# EAGLE design nautilus-board (EAGLE 9.2.2)
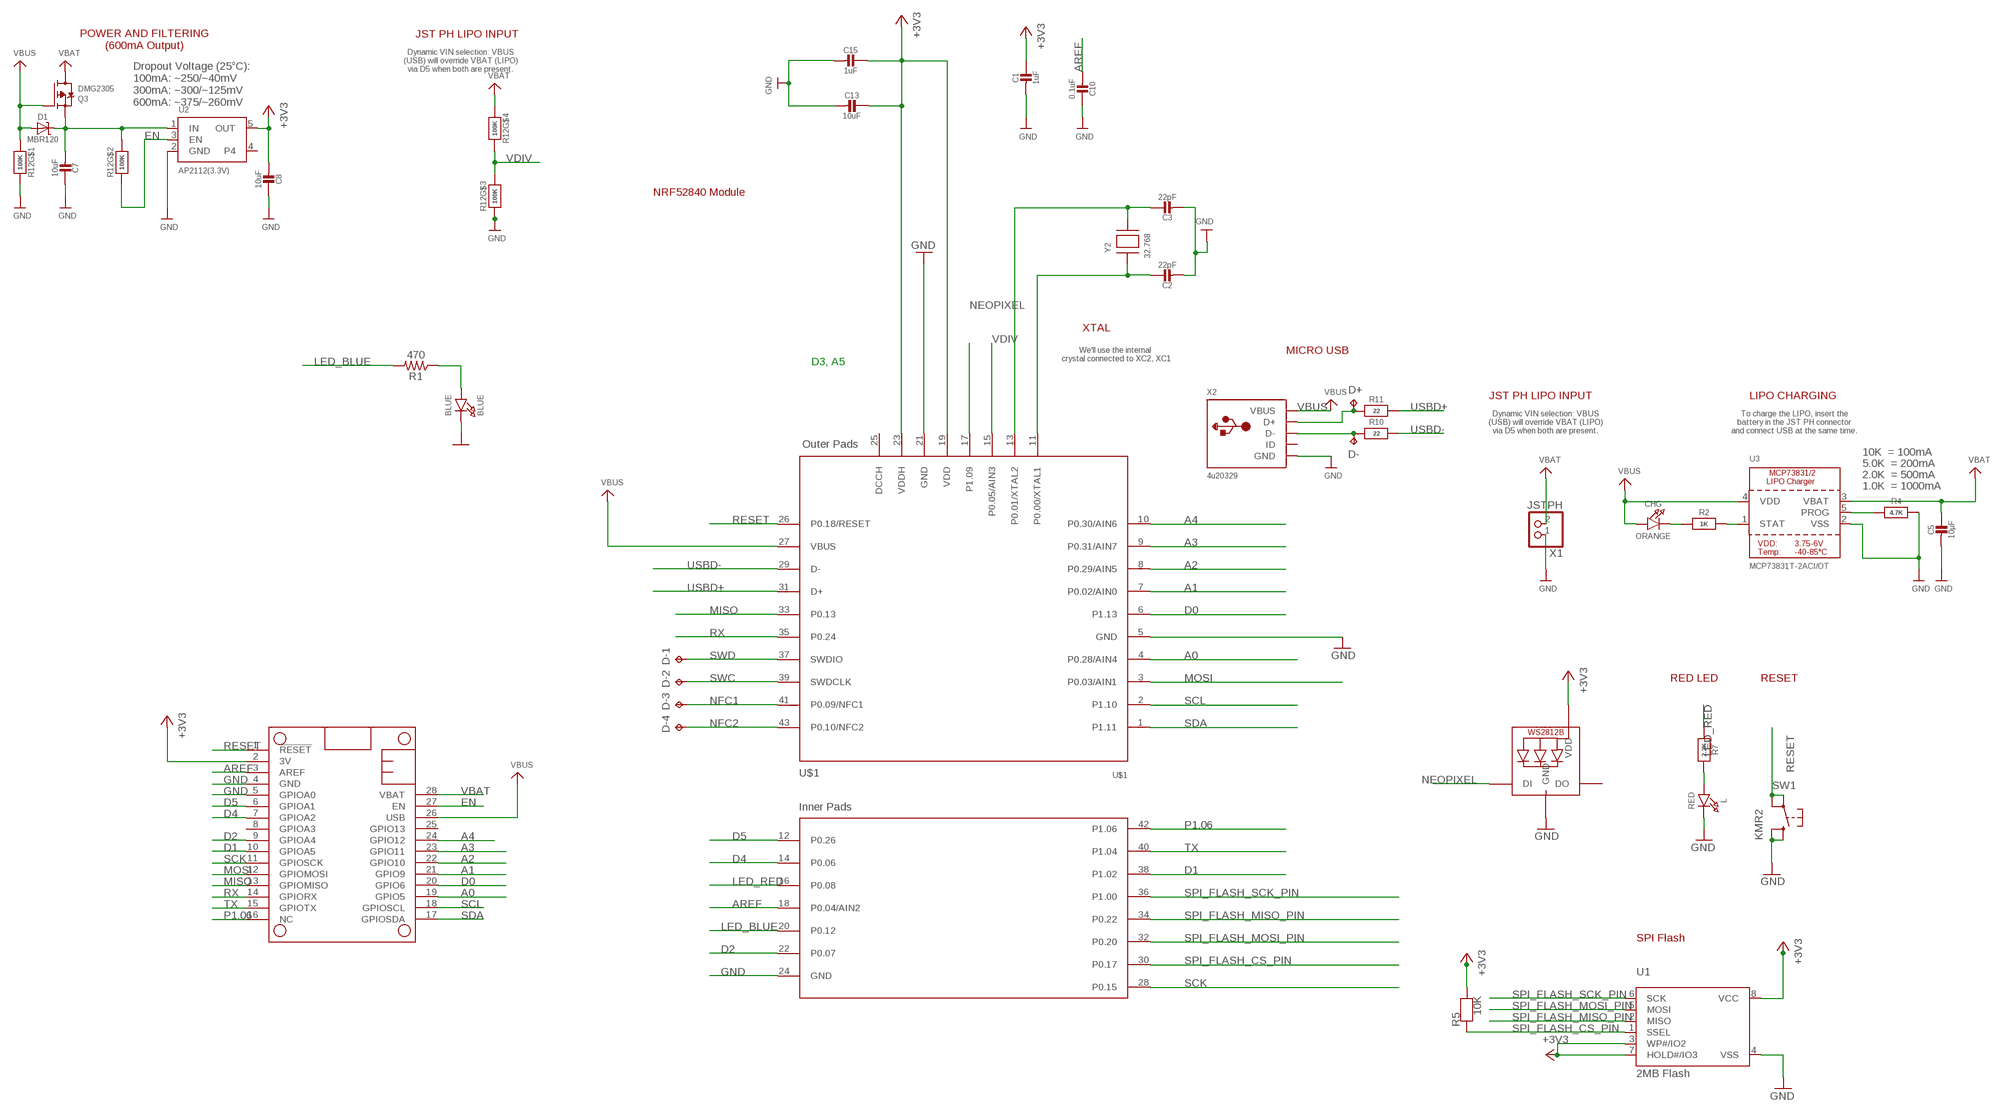
[diagram p0: schematic, sheet 1]

## Parts
BLUE  BLUE  LED0805_NOOUTLINE  [CHIPLED_0805_NOOUTLINE]
C1  1uF  CAP_CERAMIC0603_NO  [0603-NO]
C2  22pF  CAP_CERAMIC0603_NO  [0603-NO]
C3  22pF  CAP_CERAMIC0603_NO  [0603-NO]
C5  10µF  CAP_CERAMIC0805-NOOUTLINE  [0805-NO]
C7  10uF  CAP_CERAMIC0805-NOOUTLINE  [0805-NO]
C8  10uF  CAP_CERAMIC0805-NOOUTLINE  [0805-NO]
C10  0.1uF  CAP_CERAMIC0603_NO  [0603-NO]
C13  10uF  CAP_CERAMIC0805-NOOUTLINE  [0805-NO]
C15  1uF  CAP_CERAMIC0603_NO  [0603-NO]
CHG  ORANGE  LED0805_NOOUTLINE  [CHIPLED_0805_NOOUTLINE]
D1  MBR120  DIODE-SCHOTTKYSOD-123  [SOD-123]
D+  TPTP10R  [TP10R]
D-  TPTP10R  [TP10R]
D-1  TPB1,27  [B1,27]
D-2  TPB1,27  [B1,27]
D-3  TPB1,27  [B1,27]
D-4  TPB1,27  [B1,27]
L  RED  LED0805_NOOUTLINE  [CHIPLED_0805_NOOUTLINE]
LED1  WS2812B3535  [LED3535]
MS1  FEATHERWING  [FEATHERWING]
Q3  DMG2305  MOSFET-P  [SOT23-R]
R1  470  470OHM-0603-1/10W-1%  [0603]
R2  1K  RESISTOR_0603_NOOUT  [0603-NO]
R4  4.7K  RESISTOR_0603_NOOUT  [0603-NO]
R5  10K  RESISTOR_0603_NOOUT  [0603-NO]
R7  2.2K  RESISTOR_0603_NOOUT  [0603-NO]
R10  22  RESISTOR_0603_NOOUT  [0603-NO]
R11  22  RESISTOR_0603_NOOUT  [0603-NO]
R12  100K  RESISTOR_4PACK  [RESPACK_4X0603]
SW1  KMR2  SWITCH_TACT_SMT4.6X2.8  [BTN_KMR2_4.6X2.8]
U1  2MB Flash  SPIFLASH_SOIC8208MIL  [SOIC8_208MIL]
U2  AP2112(3.3V)  VREG_SOT23-5  [SOT23-5]
U3  MCP73831T-2ACI/OT  MCP73831/2  [SOT23-5]
U$1  E73-2G4M08S1C  [PE73(2G4M08S1C)]
X1  JSTPH  CON_JST_PH_2PIN  [JSTPH2]
X2  4u20329  USB_MICRO_20329_V2  [4UCONN_20329_V2]
Y2  32.768  XTAL-3.2X1.5  [XTAL3215]

## Nets
+3V3 [power]: C1.1 C8.2 C13.1 C15.1 LED1.2(VDD) MS1.2(3V) R5.2 U1.3(WP#/IO2) U1.7(HOLD#/IO3) U1.8(VCC) U2.5(OUT) U$1.19(VDD) U$1.23(VDDH)
A0: MS1.19(GPIO5) U$1.4(P0.28/AIN4)
A1: MS1.21(GPIO9) U$1.7(P0.02/AIN0)
A2: MS1.22(GPIO10) U$1.8(P0.29/AIN5)
A3: MS1.23(GPIO11) U$1.9(P0.31/AIN7)
A4: MS1.24(GPIO12) U$1.10(P0.30/AIN6)
AREF: C10.2 MS1.3(AREF) U$1.18(P0.04/AIN2)
D0: MS1.20(GPIO6) U$1.6(P1.13)
D1: MS1.10(GPIOA5) U$1.38(P1.02)
D2: MS1.9(GPIOA4) U$1.22(P0.07)
D4: MS1.7(GPIOA2) U$1.14(P0.06)
D5: MS1.6(GPIOA1) U$1.12(P0.26)
D+1: D+.TP R11.1 X2.D+
D-1: D-.TP R10.1 X2.D-
EN: MS1.27(EN) R12.2 U2.3(EN)
GND [gnd]: BLUE.C C1.2 C2.2 C3.2 C5.2 C7.1 C8.1 C10.1 C13.2 C15.2 L.C LED1.4(GND) MS1.4(GND) MS1.5(GPIOA0) R4.2 R12.3 R12.8 SW1.B'(S1) SW1.B(S) U1.4(VSS) U2.2(GND) U3.2(VSS) U$1.5(GND) U$1.21(GND) U$1.24(GND) X1.1 X2.BASE@1(GND) X2.BASE@2(GND) X2.GND X2.SPRT@1(GND) X2.SPRT@2(GND) X2.SPRT@3(GND) X2.SPRT@4(GND)
LED_BLUE: R1.2 U$1.20(P0.12)
LED_RED: R7.1 U$1.16(P0.08)
MISO: MS1.13(GPIOMISO) U$1.33(P0.13)
MOSI: MS1.12(GPIOMOSI) U$1.3(P0.03/AIN1)
N$1: CHG.C R2.1
N$2: C3.1 U$1.13(P0.01/XTAL2) Y2.P$2
N$3: L.A R7.2
N$7: C2.1 U$1.11(P0.00/XTAL1) Y2.P$1
N$8 [gnd]: BLUE.A R1.1
N$9: R2.2 U3.1(STAT)
N$10: R4.1 U3.5(PROG)
NEOPIXEL: LED1.1(DI) U$1.17(P1.09)
NFC1: D-3.TP U$1.41(P0.09/NFC1)
NFC2: D-4.TP U$1.43(P0.10/NFC2)
P1.06: MS1.16(NC) U$1.42(P1.06)
RESET: MS1.1(!RESET) SW1.A'(P1) SW1.A(P) U$1.26(P0.18/RESET)
RX: MS1.14(GPIORX) U$1.35(P0.24)
SCK: MS1.11(GPIOSCK) U$1.28(P0.15)
SCL: MS1.18(GPIOSCL) U$1.2(P1.10)
SDA: MS1.17(GPIOSDA) U$1.1(P1.11)
SPI_FLASH_CS_PIN: R5.1 U1.1(SSEL) U$1.30(P0.17)
SPI_FLASH_MISO_PIN: U1.2(MISO) U$1.34(P0.22)
SPI_FLASH_MOSI_PIN: U1.5(MOSI) U$1.32(P0.20)
SPI_FLASH_SCK_PIN: U1.6(SCK) U$1.36(P1.00)
SWC: D-2.TP U$1.39(SWDCLK)
SWD: D-1.TP U$1.37(SWDIO)
TX: MS1.15(GPIOTX) U$1.40(P1.04)
USBD+: R11.2 U$1.31(D+)
USBD-: R10.2 U$1.29(D-)
VBAT [power]: C5.1 MS1.28(VBAT) Q3.3(D) R12.4 U3.3(VBAT) X1.2
VBUS [power]: CHG.A D1.A MS1.26(USB) Q3.1(G) R12.1 U3.4(VDD) U$1.27(VBUS) X2.VBUS
VDIV: R12.5 R12.6 U$1.15(P0.05/AIN3)
VHI [power]: C7.2 D1.C Q3.2(S) R12.7 U2.1(IN)
Unconnected: LED1.3(DO) MS1.8(GPIOA3) MS1.25(GPIO13) U2.4 U$1.25(DCCH) X2.ID

## Notes on the sheet
- JST PH LIPO INPUT
- POWER AND FILTERING
  (600mA Output)
- Dynamic VIN selection: VBUS
  (USB) will override VBAT (LIPO)
  via D5 when both are present.
- Dropout Voltage (25°C):
  100mA: ~250/~40mV
  300mA: ~300/~125mV
  600mA: ~375/~260mV
- NRF52840 Module
- XTAL
- We'll use the internal 
  crystal connected to XC2, XC1
- MICRO USB
- D3, A5
- JST PH LIPO INPUT | LIPO CHARGING
- Dynamic VIN selection: VBUS
  (USB) will override VBAT (LIPO)
  via D5 when both are present.
- To charge the LIPO, insert the
  battery in the JST PH connector
  and connect USB at the same time.
- 10K  = 100mA
- 5.0K  = 200mA
- 2.0K  = 500mA
- 1.0K  = 1000mA
- RED LED | RESET
- SPI Flash

## Library data of the parts
BLUE CHG L = microbuilder:LED: LED 0603 - 0603 Surface Mount Package 2mA: Green LED - Low Power (3.9mcd, 2ma, 1.7Vf) - Digikey: 475-2709-2-ND Orange LED - Low Power (9.8mcd, 2ma, 1.8Vf) - Digikey: 475-1194-2-ND Red LED - Low Power (5mcd, 2ma, 1.8Vf) - Digikey: 475-1195-2-ND Yellow LED - Low Power (7mcd, 2ma, 1.8Vf) - Digikey: 475-1196-2-ND 5mA: Blue LED - Low Power (17mcd, 5ma, 2.9Vf) - Digikey: LNJ937W8CRACT-ND 0805 - 0805 Surface Mount Package 2mA: Red LED (8.8mcd, 2mA, 1.8Vf, Clear) - Low Power [Digikey: 475-2510-1-ND] Green LED (5mcd, 2mA, 1.8Vf, Clear) - Low Power [Digikey: 475-2730-1-ND] Yellow LED (11.3mcd, 2mA, 1.8Vf, Clear) - Low Power [Digikey: 475-2555-1-ND] 20mA: Red LED (104mcd, 20mA, Diffused) - LS R976 [Digikey: 475-1278-6-ND] Red LED (12mcd, 20mA, 2.0Vf, Clear) - APT2012EC [Digikey: 754-1128-1-ND] Green LED (15mcd, 20mA, 2.2Vf, Clear) - APT2012GC [Digikey: 754-1131-1-ND] Orange LED (160mcd, 20mA, 2.1Vf, Clear) - APT2012SECK [Digikey: 754-1130-1-ND] 1206 - 1206 Surface Mount Package Green LED (26mcd, 20mA, Diffused) - LG N971 [Digikey: 475-1407-6-ND] Red LED (15mcd, 20mA, Diffused) - LH N974 [Digikey: 475-1416-6-ND] Cree - Cree High-Power Surface Mount LEDs XPEBWT-L1-0000-00D50 - White 111lm 350mA 2.9Vf 6200K 110° XTEAWT-00-0000-00000LEE3 - White 114lm 350mA 2.85Vf 5000K 115° Everlight - Everlight 45-21 Series Surface Mount LEDs 45-21/QK2C-B2832AC2CB2/2T - Warm White 2000mcd 20mA 3.25Vf 3050K 120° 45-21/LK2C-B38452C4CB2/2T - Nuetral White 2000mcd 20mA 3.25Vf 4150K 120° 45-21/LK2C-B50634C6CB2/2T - Cold White 2200mcd 20mA 3.25Vf 5650K 120° PLCC2 Reverse Mount LS T77K-J1L2-1-0-2-R18-Z - Red 11.25mcd 2mA 1.8Vf 630nm 120° LO T77K-L1M2-24-Z - Orange 19.6mcd 2mA 1.8Vf 606nm 120° LY T77K-K2M1-26-Z - Yellow 15.7mcd 2mA 1.8Vf 587nm 120°
C1-C3 C5 C7 C8 C10 C13 C15 = microbuilder:CAP_CERAMIC: Ceramic Capacitors For new designs, use the packages preceded by an '_' character since they are more reliable: The following footprints should be used on most boards: _0402 - Standard footprint for regular board layouts _0603 - Standard footprint for regular board layouts _0805 - Standard footprint for regular board layouts _1206 - Standard footprint for regular board layouts For extremely tight-pitch boards where space is at a premium, the following 'micro-pitch' footprints can be used (smaller pads, no silkscreen outline, etc.): _0402MP - Micro-pitch footprint for very dense/compact boards _0603MP - Micro-pitch footprint for very dense/compact boards _0805MP - Micro-pitch footprint for very dense/compact boards _1206MP - Micro-pitch footprint for very dense/compact boards
D1 = microbuilder:DIODE-SCHOTTKY
D+ D- D-1-D-4 = testpad:TP: Test pad
LED1 = microbuilder:WS2812B
MS1 = microbuilder:FEATHERWING
Q3 = microbuilder:MOSFET-P: P-Channel Mosfet LEGEND VDS: Voltage Drain-Source ID: Drain Current RDS(ON): Drain-Source On-State Resistance VGS(TH): Gate-Source Threshold Voltage CISS: Drain-Source Input Capacitance SOT-23 Name VDS ID RDS(ON) VGS(TH) CISS Order Number IRLML5103 30V 760mA 600 mOhm -- 75pF @ 25V Digikey: IRLML5103PBFCT-ND IRLML6401 12V 4.3A 50 mOhm 950mV @ 250µA 830pF @ 10V Digikey: IRLML6401PBFTR-ND NTR0202PL 20V 400mA 800 mOhm 2.3V @ 250uA 70pF @ 5V Digikey: NTR0202PLT1GOSTR-ND NTR4101PT1G 20V 1.8A 85 mOhm 1.2V @ 250uA 675pF @ 10V Digikey: NTR4101PT1GOSCT-ND DMP2004K 20V 600mA 900 mOhm 1V @ 250uA 175pF @ 16V Digikey: DMP2004KDICT-ND PMV65XP 20V 3.9A 76 mOhm 950mV @ 1mA 725pF @ 20V Digikey: 568-2358-2-ND TO-252 Name VDS ID RDS(ON) VGS(TH) CISS Order Number AOD417 30V 25A 34 mOhm 3V @ 250µA 920pF @ 15V Digikey: 785-1106-2-ND PowerPak Name VDS ID RDS(ON) VGS(TH) CISS Order Number AON7401 30V 12A 14 mOhm 3V @ 250µA 2600pF @ 15V Digikey: 785-1302-1-ND
R1 = SparkFun-Resistors:470OHM: 470Ω resistor A resistor is a passive two-terminal electrical component that implements electrical resistance as a circuit element. Resistors act to reduce current flow, and, at the same time, act to lower voltage levels within circuits. - Wikipedia; PROD_ID: RES-07869
R2 R4 R5 R7 R10 R11 = microbuilder:RESISTOR: Resistors For new designs, use the packages preceded by an '_' character since they are more reliable: The following footprints should be used on most boards: _0402 - Standard footprint for regular board layouts _0603 - Standard footprint for regular board layouts _0805 - Standard footprint for regular board layouts _1206 - Standard footprint for regular board layouts For extremely tight-pitch boards where space is at a premium, the following 'micro-pitch' footprints can be used (smaller pads, no silkscreen outline, etc.): _0402MP - Micro-pitch footprint for very dense/compact boards _0603MP - Micro-pitch footprint for very dense/compact boards _0805MP - Micro-pitch footprint for very dense/compact boards _1206MP - Micro-pitch footprint for very dense/compact boards
R12 = microbuilder:RESISTOR_4PACK: Resistor Packs (4 resistors) 4 x 0603 10K 1/16W - Digikey: YC164J-10KCT-ND
SW1 = microbuilder:SWITCH_TACT_SMT: SMT Tact Switches 6x6mm - Digikey: P12940SCT-ND KMR2 (4.6x2.8mm) - Digikey: 401-1426-1-ND EVQ-PQHB55 - Light Touch, 160GF (4.5x4.5mm) - Digikey: P8090SCT-ND KMT0 - KMT021 NGJ LHS (etc.) IP68/Waterproof - Digikey: CKN10289CT-ND
U1 = microbuilder:SPIFLASH_SOIC8: SOIC8 SPI Flash Be careful with the size since SOIC8 flash comes in several 'widths' SOIC8 150 mil M25P16 - 16Mbit (2Mbit x 8) Serial Flash (75MHz SPI Bus), Supply: 2.7-3.6V Digikey: SOIC8 - M25P16-VMN6P-ND SOIC8 208 mil W25Q16BVSSIG - 16Mbit (2Mbit x 8) Serial Flash (104MHz SPI Bus), Supply: 2.7-3.6V Digikey: SOIC8 - W25Q16BVSSIG-ND
U2 = microbuilder:VREG_SOT23-5: SOT23-5 Fixed Voltage Regulators Part Current Out V Out V In V Dropout θJA (°C/W) TJ (°C) Digikey Part No. ADP121 150mA 3.3V 3.4-5.5V 0.09V @ 150mA -- -- ADP121-AUJZ33R7CT-ND ADP121 150mA 3.0V 3.1-5.5V 0.09V @ 150mA -- -- ADP121-AUJZ30R7CT-ND ADP122 300mA 3.3V 3.4-5.5V 0.085V @ 300mA -- -- ADP122AUJZ-3.3-R7CT-ND ADP1712 300mA 3.3V 3.5-5.5V 0.17V @ 300mA -- -- ADP1712AUJZ-3.3-R7TR-ND AP7311 (Low Cost) 150mA 3.3V 3.5-6V 0.15V @ 150mA -- -- AP7311-33WG-7DICT-ND LD39015M18R 150mA 1.8V 1.9V-5.5V 0.08V @ 100mA -- -- 497-6977-1-ND LP2985A-33DBVR 150mA 3.3V 3.3-16V 0.28V @ 150mA 206 150 296-18479-1-ND MCP1824T-3302E/OT 300mA 3.3V 3.5V-6V 0.2V @ 300mA -- -- MCP1824T-3302E/OTCT-ND MIC5205-2.5YM5 TR 150mA 2.5V 2.7-16V 0.165V @ 150mA -- -- 576-1257-2-ND MIC5205-3.0YM5 TR 150mA 3.0V 3.2V-16V 0.165V @ 150mA -- -- 576-1258-2-ND MIC5205-3.3YM5 TR 150mA 3.3V 3.5V-16V 0.165V @ 150mA -- -- 576-1259-2-ND TPS780330220 150mA 3.3V+2.2V 3.6-5.5V 250mV Max -- -- 296-23332-1-ND TDA3663/N1,135 100mA 3.3V 3.5-45V 0.18V @ 50mA -- -- 568-5343-1-ND Max operating temp can be calculated using θJA, TJ (max junction temperature), and power in watts. Set the "Maximum Ambient Temperature" until it reaches TJ ("Max Junction Temperature"), which is the absolute limit for safe use of the regulator: Heat Sink Temperature Calculator <http://www.daycounter.com/Calculators/Heat-Sink-Temperature-Calculator.phtml> For example, With 12V source into a 3.3V LP2985 and a 30mA load, we are dissipating (12V-3.3V) * 0.03A = 0.261W. With a θJA of 206 °C/W, a TJ of 150°C, and 261mW we can safely use the chip without a heat sink up to 75°C (=147.1°C Junction Temperature).
U3 = microbuilder:MCP73831/2: MCP73831/2 LIPO Charger VDD: 3.75 - 6V Temp -40 - 85°C Programmable Charge Rate: 15-500mA NOTE: STAT is a tri-state logic output on the MCP73831 and an open-drain output on the MCP73832. SOT23-5 with 4.2V output and tri-state logic on STAT = MCP73831T-2ACI/OT
U$1 = E73:E73-2G4M08S1C: E73-2G4M08S1C IC : nRF52840 Frequency : 2.360~2.500GHz Protocol : BLE 4.2/5.0 Distance : 120m Interface : I/O The original imported nRF52840 chip, supporting BLE 4.2 and BLE 5.0. With high performance ARM CORTEX-M4F kernel and 4 layer PCB borad, the module can be passed through various certification. As the hardware platform only, the most of the IO port is led out for secondary development The module has 32.768K real time clock.
X1 = microbuilder:CON_JST_PH_2PIN: JST 2-Pin Right-Angle Connector PH-Series - 4UConnector: 17311 SH-Series - 4UConnector: 07278
X2 = microbuilder:USB: USB Connectors USBMINIB - Surface Mount Female Mini-B USB Connector 4UConnector: 06564
Y2 = adafruit2:XTAL: Low cost SMT crystals, no capacitors included http://www.ladyada.net/library/eagle

## Net classes
1 power: width 0.254 mm
2 gnd: width 0.254 mm

## Board
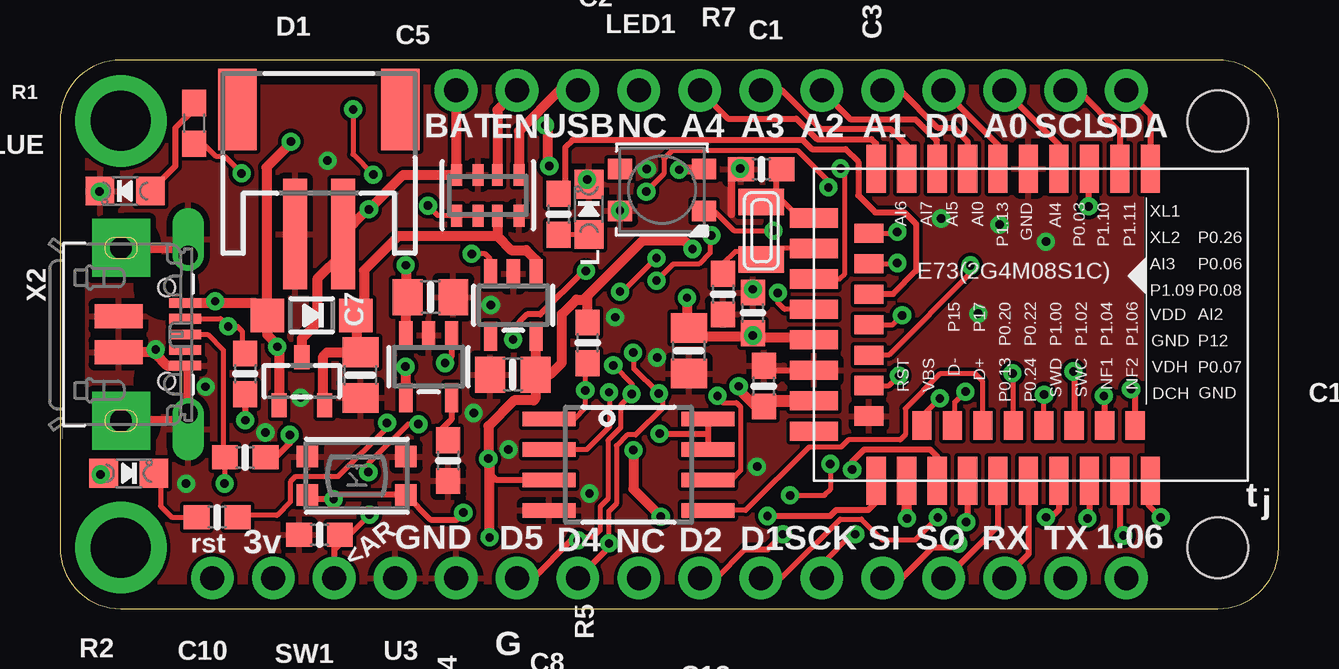
[diagram p1: board, top side]
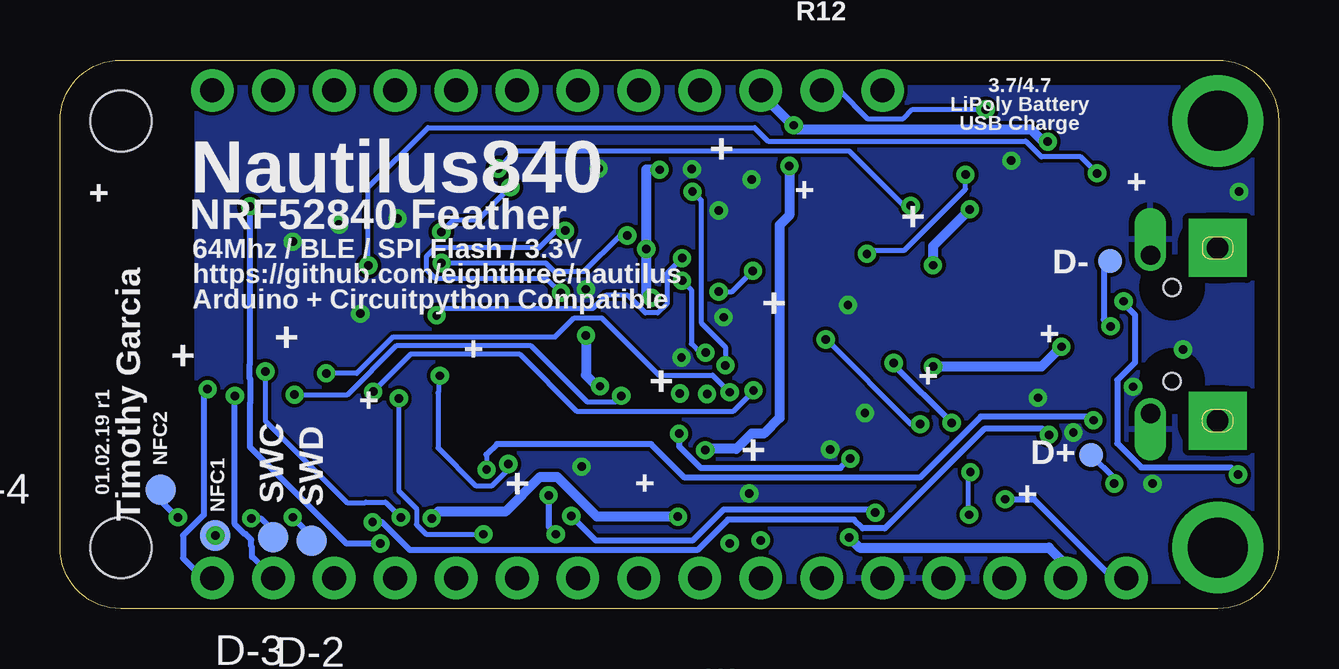
[diagram p2: board, bottom side, seen from below]

Size 50.8 x 22.86 mm. Coordinates in mm from the lower left corner, seen from the top.
Copper layers (1*16): Top 0.035mm / dielectric 1.5mm / Bottom 0.035mm
Design rules "default *": minimum track width 6mil, minimum drill 0.35mm, track to track 6mil, track to pad 6mil, pad to pad 6mil, via to via 6mil, smd to smd 6mil, copper to edge 40mil, drill to drill 6mil, minimum pad ring 10mil, minimum via ring 8mil, stop-mask expansion 2mil, vias tented up to drill 20mil, thermal gap 10mil

### Footprints (pad centres in the part's own frame; a part is rotated, then mirrored left to right if it is on the bottom)
CHIPLED_0805_NOOUTLINE = smd 1.2 x 1.2: A 0,-1.05; C 0,1.05
0603-NO = smd 1.075 x 1: 1 -0.85,0; 2 0.85,0
0805-NO = smd 1.24 x 1.5: 1 -0.95,0; 2 0.95,0
SOD-123 = smd 1.4 x 1.4: A 1.85,0; C -1.85,0
TP10R = smd 1 x 1: TP 0,0
B1,27 = smd 1.27 x 1.27: TP 0,0
LED3535 = smd 1 x 0.85: 1 -1.75,0.875; 2 -1.75,-0.875; 3 1.75,-0.875; 4 1.75,0.875
FEATHERWING = drill 1 pad 1.778: 1 6.35,1.27; 2 8.89,1.27; 3 11.43,1.27; 4 13.97,1.27; 5 16.51,1.27; 6 19.05,1.27; 7 21.59,1.27; 8 24.13,1.27; 9 26.67,1.27; 10 29.21,1.27; 11 31.75,1.27; 12 34.29,1.27; 13 36.83,1.27; 14 39.37,1.27; 15 41.91,1.27; 16 44.45,1.27; 17 44.45,21.59; 18 41.91,21.59; 19 39.37,21.59; 20 36.83,21.59; 21 34.29,21.59; 22 31.75,21.59; 23 29.21,21.59; 24 26.67,21.59; 25 24.13,21.59; 26 21.59,21.59; 27 19.05,21.59; 28 16.51,21.59 | drill 2.5 pad 3.81: P$1 2.54,20.32; P$2 2.54,2.54 | hole 2.54: 48.26,20.32; 48.26,2.54
SOT23-R = smd 0.635 x 1.016: 1 -0.95,-1; 2 0.95,-1; 3 0,1
0603 = smd 1.1 x 1: 1 -0.85,0; 2 0.85,0
RESPACK_4X0603 = smd 0.45 x 0.9: 1 -1.3,-0.85; 2 -0.4,-0.85; 3 0.4,-0.85; 4 1.3,-0.85; 5 1.3,0.85; 6 0.4,0.85; 7 -0.4,0.85; 8 -1.3,0.85
BTN_KMR2_4.6X2.8 = smd 0.9 x 0.9: A 2.05,0.8; A' -2.05,0.8; B 2.05,-0.8; B' -2.05,-0.8
SOIC8_208MIL = smd 0.6 x 2.2: 1 -1.905,-3.315; 2 -0.635,-3.315; 3 0.635,-3.315; 4 1.905,-3.315; 5 1.905,3.315; 6 0.635,3.315; 7 -0.635,3.315; 8 -1.905,3.315
SOT23-5 = smd 0.55 x 1.2: 1 -0.95,-1.3; 2 0,-1.3; 3 0.95,-1.3; 4 0.95,1.3; 5 -0.95,1.3
PE73(2G4M08S1C) = smd 0.8 x 2: 1 14.03,13; 2 12.76,13; 3 11.49,13; 4 10.22,13; 5 8.95,13; 6 7.68,13; 7 6.41,13; 8 5.14,13; 9 3.873,13; 10 2.6,13; 26 2.6,0; 27 3.87,0; 29 5.14,0; 31 6.41,0; 33 7.68,0; 35 8.95,0; 37 10.22,0; 39 11.49,0; 41 12.757,0; 43 14.03,0 | smd 2 x 0.8: 11 0,10.945; 13 0,9.675; 15 0,8.405; 17 0,7.135; 19 0,5.865; 21 0,4.595; 23 0,3.325; 25 0,2.055 | smd 1.2 x 0.8: 12 2.3,10.31; 14 2.3,9.04; 16 2.3,7.77; 18 2.3,6.5; 20 2.3,5.23; 22 2.3,3.96; 24 2.3,2.69 | smd 0.8 x 1.2: 28 4.505,2.3; 30 5.775,2.3; 32 7.045,2.3; 34 8.315,2.3; 36 9.585,2.3; 38 10.855,2.3; 40 12.125,2.3; 42 13.39,2.3
JSTPH2 = smd 1 x 4.6: 1 -1,-3.7; 2 1,-3.7 | smd 1.6 x 3.4: NC1 -3.4,1.5; NC2 3.4,1.5
4UCONN_20329_V2 = smd 1 x 2: BASE@1 -0.75,-2; BASE@2 0.75,-2 | smd 0.4 x 1.35: D+ 0,0.775; D- -0.65,0.775; GND 1.3,0.775; ID 0.65,0.775; VBUS -1.3,0.775 | drill 0.8 pad 1.143 offset: SPRT@1 -3.3,0.9; SPRT@2 3.3,0.9 | drill 0.9 pad 2.413 square: SPRT@3 -3.6,-1.9; SPRT@4 3.6,-1.9 | hole 0.7: -1.95,0; 1.95,0
XTAL3215 = smd 1.1 x 1.9: P$1 1.2,0; P$2 -1.2,0

### Placement (x,y rotation side)
BLUE  2.72,17.4 90 top
C1  28.88,12.32 90 top
C2  29.24,18.31 180 top
C3  27.64,13.11 270 top
C5  15.44,12.98 0 top
C7  12.52,9.73 90 top
C8  18.87,9.75 0 top
C10  10.82,3.07 0 top
C13  26.21,10.74 270 top
C15  29.34,9.27 90 top
CHG  2.87,5.64 270 top
D1  10.49,12.22 180 top
D+  7.82,6.4 0 bottom
D-  7.04,14.48 0 bottom
D-1  40.31,2.82 0 bottom
D-2  41.91,2.97 0 bottom
D-3  44.32,3.05 0 bottom
D-4  46.61,4.95 0 bottom
L  22.05,16.64 0 top
LED1  25.1,17.45 180 top
MS1  0,0 0 top
Q3  10.08,9.47 0 top
R1  5.59,20.22 270 top
R2  6.55,3.81 0 top
R4  16.18,6.17 270 top
R5  22,11.07 90 top
R7  20.78,16.43 270 top
R10  7.72,9.78 270 top
R11  7.72,6.3 0 top
R12  17.83,17.22 180 top
SW1  12.37,5.54 180 top
U1  23.7,5.99 270 top
U2  18.9,12.65 180 top
U3  15.37,10.08 180 top
U$1  31.42,5.33 0 top
X1  10.79,19.3 0 top
X2  4.45,11.43 270 top
Y2  29.24,15.75 90 top

### Tracks (layer width: path | path; a pad name or v marks a point on that pad's centre or on a via)
+3V3  (via drill 0.35)
  Top 0.254: 27.01,7.29 U1.7 | U1.3 18.2,5.36 17.97,5.59 17.91,5.59 | v24.99,7.29 27.01,7.29 | U1.8 27.01,7.29
  Top 0.406: U2.5 19.82,11.32 C8.2 | C1.1 28.75,11.34 26.57,11.34 C13.1 26.14,11.77 v26.14,12.95 | U$1.19 31.32,11.3 28.88,11.3 C1.1 | LED1.2 26.81,18.29 v25.81,18.29 | C8.2 20.42,9.75 20.92,10.25 20.92,12.27 21.52,12.88 21.83,12.88 22,13.04 | R5.2 22,13.04 | v26.36,14.99 26.01,15.34 24.29,15.34 22,13.04 | C8.2 19.82,8.75 19.76,8.68 18.93,8.68 17.86,7.61 v17.86,6.25 | v17.86,6.25 17.91,6.2 17.91,5.59 | v17.86,6.25 17.88,6.27 17.88,3 v17.91,2.97 | C1.1 v28.88,11.38 | v28.29,9.27 28.29,9.14 29.01,8.42 C15.1
  Top 0.508: U$1.23 29.57,8.66 C15.1
  Bottom 0.254: v24.99,7.29 24.99,6.77 24.09,5.87 18.26,5.87 17.88,6.25 v17.86,6.25
  Bottom 0.406: v25.81,18.29 26.36,18.29 v26.36,14.99 26.36,13.18 v26.14,12.95 | v17.91,2.97 17.48,2.54 9.58,2.54 8.89,1.85 MS1.2 | v28.88,11.38 28.88,9.73 28.42,9.27 v28.29,9.27
A0
  Top 0.254: U$1.4 41.64,19.32 MS1.19
A1
  Top 0.254: MS1.21 35.03,21.59 36.58,20.04 37.26,20.04 37.83,19.47 U$1.7
A2
  Top 0.254: U$1.8 36.56,19.5 36.42,19.63 36.41,19.63 35.67,20.37 32.97,20.37 MS1.22
A3
  Top 0.254: U$1.9 35.29,19.32 34.65,19.96 31.72,19.96 30.1,21.59 MS1.23
A4
  Top 0.254: MS1.24 27.84,20.42 30.69,20.42 31.55,19.56 33.83,19.56 34.02,19.37 U$1.10
AREF  (via drill 0.35)
  Top 0.203: U$1.18 34.72,11.83 v35.1,12.22 | v14.95,7.69 14.51,7.69 12.85,6.03 v12.85,5.69 | v12.9,3.91 11.43,2.44 MS1.3 | v23.34,13.21 23.44,13.21 24.84,14.61 v24.87,14.61
  Top 0.254: C10.2 11.43,2.83 MS1.3 | v18.89,11.21 18.89,11.67 19.47,12.26 20.02,12.26 21.83,14.07 v21.92,14.07
  Bottom 0.203: v18.89,11.21 18.86,11.21 15.33,7.69 v14.95,7.69 | v23.34,13.21 22.78,13.21 v21.92,14.07 | v12.85,5.69 12.95,5.59 12.95,3.96 v12.9,3.91 | v35.1,12.22 34.82,12.5 28.6,12.5 28.04,13.06 27.13,13.06 26.4,12.32 25.88,12.32 25.5,12.69 25.5,13.97 v24.87,14.61
D0
  Top 0.254: U$1.6 39.1,19.32 MS1.20
D1  (via drill 0.35)
  Top 0.203: MS1.10 30.06,1.27 32.52,3.73 33.41,3.73 34.28,2.87 35.66,2.87 v36.59,3.8
  Top 0.254: U$1.38 42.27,9.85 v42.24,9.88
  Bottom 0.203: v42.24,9.88 42.24,7.82 38.84,4.42 38.08,4.42 38.06,4.44 37.23,4.44 v36.59,3.8
D2  (via drill 0.35)
  Top 0.203: v32.11,6.03 32.11,4.96 31.87,4.72 v30.43,4.72 | U$1.22 34.56,9.29 v34.97,9.71 | MS1.9 27.36,1.27 28.55,2.47
  Top 0.254: v30.13,3.1 29.5,2.47 28.55,2.47
  Bottom 0.203: v34.97,9.71 35.02,9.65 35.02,9.02 35.05,8.99 35.05,6.7 33.48,5.13 32.79,5.13 32.11,5.81 v32.11,6.03
  Bottom 0.254: v30.43,4.72 30.43,3.4 v30.13,3.1
D4  (via drill 0.35)
  Top 0.203: U$1.14 34.87,14.37 v34.9,14.4 | v24.87,13.66 25.55,14.35 26.63,14.35 27.1,14.83 27.1,15.49 v27.15,15.54 | v23.89,10.67 23.92,10.67 23.92,10.01 v24.96,8.97 25.11,8.81 25.11,8.36 24,7.24 23.64,7.24 23.19,6.79 23.19,4.37 22.89,4.06 v22.89,2.72
  Top 0.254: v22.89,2.72 22.89,2.56 MS1.7
  Bottom 0.203: v27.15,15.54 27.46,15.54 28.95,14.05 30.2,14.05 30.56,14.4 v34.9,14.4 | v24.87,13.66 24.49,13.28 24.49,11.03 24.12,10.67 v23.89,10.67
D5  (via drill 0.35)
  Top 0.203: U$1.12 34.85,15.64 v34.9,15.7 | v21.59,2.85 21.72,2.97 22.23,2.97 22.52,3.26 22.52,4.25 22.84,4.57 22.84,7.01 23.37,7.54 23.37,8.48 v23.82,8.94 23.85,8.97 23.85,9.35 v23.06,10.13 | v24.43,17.37 25.17,18.11 25.17,18.75 25.5,19.08 30.75,19.08 32.03,17.8 v32.03,17.55
  Top 0.254: v21.59,2.85 21.31,2.85 19.74,1.27 MS1.6
  Bottom 0.203: v24.43,17.37 24.08,17.02 24.08,11.91 23.06,10.9 v23.06,10.13 | v32.03,17.55 33.38,16.2 34.39,16.2 v34.9,15.7
D+1  (via drill 0.35)
  Top 0.203: X2.D+ 6.15,11.43 6.81,10.77 6.81,6.43 6.87,6.43 R11.1 6.87,5.23 v6.86,5.21
  Bottom 0.254: D+.TP 6.86,5.43 v6.86,5.21
D-1  (via drill 0.35)
  Top 0.203: X2.D- 6.69,12.08 v7.01,11.76 7.39,11.76 7.59,11.56 7.59,10.76 R10.1
  Bottom 0.254: D-.TP 7.29,14.22 7.29,12.04 v7.01,11.76
EN  (via drill 0.35)
  Top 0.203: v12.22,20.8 12.22,18.92 v13.06,18.09 | U2.3 17.95,14.56 17.72,14.78 v17.16,14.78
  Top 0.406: MS1.27 18.24,20.78 R12.2
  Bottom 0.203: MS1.27 18.31,21.59 17.14,20.42 15.65,20.42 15.27,20.8 v12.22,20.8 | v17.16,14.78 17.16,14.94 15.6,14.94 13.06,17.48 v13.06,18.09
GND  (via drill 0.35)
  Top 0.254: C15.2 29.53,9.93 U$1.21
  Top 0.305: C2.2 27.98,17.91 27.98,16.44
  Top 0.406: X2.BASE@2 3.87,10.68 v3.99,10.79 3.99,10.59 4.45,10.13 X2.GND 5.34,10.01 X2.SPRT@2 5.04,7.83 X2.SPRT@4 | X2.SPRT@3 5.04,15.03 X2.SPRT@1
  other vias: 6.07,9.25 5.26,5.21 17.25,8.15 10.03,8.79 1.65,17.37 38.28,12.29 11.15,18.67 8.56,7.34 17.96,12.65 23.14,12.14 18.69,6.63 24.89,10.46 24.46,18.31 41.1,15.29 39.17,16 36.73,16.26 21.97,17.88 23.34,16.59 28.88,13.31 28.35,18.34 29.06,5.92 22.07,4.8
  pour Top: -0.15,23.09 -0.15,-0.03 -0.23,-0.1 45.11,-0.1 45.11,23.42 -0.05,23.42 -0.28,23.19
  pour Bottom: -0.28,23.14 -0.28,-0.2 45.09,-0.2 45.09,23.47 -0.05,23.47 -0.23,23.29 -0.23,23.04
LED_BLUE  (via drill 0.35)
  Top 0.203: v7.57,18.14 6.86,18.85 6.49,18.85 5.97,19.37 R1.2 | v37.95,14.3 37.95,13.96 34.55,10.56 U$1.20
  Bottom 0.203: v7.57,18.14 8.26,18.82 9.89,18.82 10.54,19.48 21.29,19.48 21.85,20.04 35.46,20.04 37.95,17.55 v37.95,14.3
LED_RED
  Top 0.254: R7.1 21.06,17.56 21.06,19.21 21.36,19.52 30.98,19.52 31.34,19.15 32.74,19.15 33.27,18.62 33.27,17.22 33.98,16.51 35.2,16.51 35.68,16.03 35.68,14.07 34.72,13.1 U$1.16
MISO
  Top 0.254: U$1.33 39.1,3.44 36.93,1.27 MS1.13
MOSI  (via drill 0.35)
  Top 0.254: MS1.12 35.1,1.27 36.37,2.54 37.27,2.54 v37.45,2.71 | v42.88,16.76 42.88,18.3 U$1.3
  Bottom 0.254: v37.45,2.71 38.86,2.71 42.88,6.73 42.88,8.57 42.85,8.59 42.85,9.56 42.9,9.61 42.9,10.15 42.88,10.18 v42.88,16.76
N$1
  Top 0.203: CHG.C 4.19,5.37 4.19,4.27 4.65,3.81 R2.1
N$2
  Top 0.203: U$1.13 29.7,15.01 Y2.P$2 28.91,14.88 28.15,14.88 27.64,14.36 C3.1
N$3
  Top 0.203: L.A R7.2
N$7
  Top 0.203: U$1.11 31.17,16.53 30.58,16.53 30.05,17.07 29.84,17.07 29.35,17.07 Y2.P$1
  Top 0.254: C2.1 29.84,18.07 29.84,17.07
N$8
  Top 0.254: R1.1 5.59,20.81 4.81,20.03 4.81,18.44 BLUE.A
N$9  (via drill 0.35)
  Top 0.203: v13.63,7.74 13.63,7.54 11.6,5.51 9.82,5.51 9.6,5.28 9.6,4.45 9.04,3.89 7.59,3.89 7.52,3.81
  Top 0.254: U3.1 16.32,10.5 v16.05,10.24 | 7.52,3.81 R2.2
  Bottom 0.254: v16.05,10.24 16.05,10.16 v13.63,7.74
N$10
  Top 0.254: U3.5 16.32,7.88 15.82,7.38 R4.1
NEOPIXEL  (via drill 0.35)
  Top 0.203: U$1.17 30.2,12.47 29.92,12.75 v29.92,13.16 | v29.74,15.75 28.09,15.75 27.27,16.57 LED1.1
  Bottom 0.203: v29.92,13.16 30.53,13.77 35.16,13.77 35.53,14.14 35.53,14.66 35.16,15.03 30.84,15.03 30.12,15.75 v29.74,15.75
NFC1  (via drill 0.35)
  Top 0.254: U$1.41 44.18,3.19 D-3.TP
  other vias: 44.32,3.05
NFC2  (via drill 0.35)
  Top 0.254: U$1.43 45.37,5.26 45.37,4.31 v45.88,3.8
  Bottom 0.254: D-4.TP 46.61,4.5 45.91,3.8 v45.88,3.8
P1.06  (via drill 0.35)
  Top 0.254: v44.65,9.15 44.81,8.99 U$1.42
  Bottom 0.254: v44.65,9.15 44.81,9.15 44.81,3.91 45.67,3.05 45.67,2.11 44.83,1.27 MS1.16
RESET  (via drill 0.35)
  Top 0.254: SW1.A 10.5,4.56 v11.4,4.56 11.58,4.74 SW1.A' 15.44,3.71 16.55,3.71 16.83,3.99 v16.82,4 | U$1.26 34.02,4.44 33.7,4.12 32.36,4.12 32.11,3.86 v29.49,3.86
  Bottom 0.254: v11.4,4.56 10.2,4.56 6.91,1.27 MS1.1 | v29.49,3.86 28.48,2.85 24.42,2.85 23.12,4.14 16.95,4.14 v16.82,4
RX
  Top 0.254: U$1.35 40.37,2.27 MS1.14
SCK  (via drill 0.35)
  Top 0.203: v36.68,8.76 36.02,8.1 36.02,7.73 U$1.28 | v33.15,3.1 33,3.1 31.75,1.85 MS1.11
  Bottom 0.203: v33.15,3.1 35.54,3.1 35.94,3.5 35.94,4.16 36.68,4.9 v36.68,8.76
SCL
  Top 0.254: MS1.18 42.44,21.59 44.18,19.85 U$1.2
SDA
  Top 0.254: MS1.17 45.45,20.59 U$1.1
SPI_FLASH_CS_PIN  (via drill 0.35)
  Top 0.203: U$1.30 37.29,7.73 37.29,8.59 v37.74,9.04 | U1.1 21.43,7.9 21.89,8.37 v21.89,9.09 21.89,10.12 R5.1
  Bottom 0.203: v37.74,9.04 36.17,10.62 31.65,10.62 29.27,8.23 22.73,8.23 21.89,9.07 v21.89,9.09
SPI_FLASH_MISO_PIN  (via drill 0.35)
  Top 0.203: U$1.34 39.73,9.77 v39.7,9.8 | U1.2 21.95,6.63 22.91,7.59 22.91,9.01 v22.89,9.01
  Bottom 0.203: v22.89,9.01 23.6,9.72 25.83,9.72 28.22,12.11 29.37,12.11 30.16,11.33 36.91,11.33 38.43,9.8 v39.7,9.8
SPI_FLASH_MOSI_PIN
  Top 0.203: U1.5 28.57,4.09 31.22,6.73 32.56,6.73 32.86,7.04 35.03,7.04 35.23,7.24 35.23,8.33 36.68,9.78 38.16,9.78 38.47,9.47 U$1.32
SPI_FLASH_SCK_PIN  (via drill 0.35)
  Top 0.203: U$1.36 41.01,8.9 v41.02,8.91 | U1.6 27.97,5.36 28.37,5.76 28.37,8.4 28.19,8.59 27.61,8.59 27.41,8.79 v27.41,8.87
  Bottom 0.203: v41.02,8.91 38.82,8.91 36.76,10.97 31.19,10.97 28.83,8.61 27.66,8.61 v27.41,8.87
SWC  (via drill 0.35)
  Top 0.254: U$1.39 42.91,3.83 42.9,3.83 v42.83,3.76
  Bottom 0.254: v42.83,3.76 42.42,3.76 41.91,3.25 D-2.TP
SWD  (via drill 0.35)
  Top 0.254: U$1.37 41.64,4.12 41.45,3.94 41.23,3.94 v41.1,3.81
  Bottom 0.254: v41.1,3.81 40.31,3.02 D-1.TP
TX  (via drill 0.35)
  Top 0.254: U$1.40 43.55,8.83 v43.51,8.87
  Bottom 0.254: MS1.15 42.8,2.16 42.8,2.57 42.82,2.59 42.82,2.87 43.06,3.1 43.1,3.1 43.51,3.51 v43.51,8.87
USBD+  (via drill 0.35)
  Top 0.254: U$1.31 37.83,3.61 v37.77,3.61 | v9.58,7.24 9.58,6.88 8.99,6.3 R11.2
  Bottom 0.254: v37.77,3.61 37.38,3.61 36.21,2.44 24.23,2.44 22.96,3.71 17.7,3.71 17.34,3.34 16.42,3.34 12.27,7.49 9.83,7.49 v9.58,7.24
USBD-  (via drill 0.35)
  Top 0.254: R10.2 v7.72,7.85 | U$1.29 36.56,6.34 36.27,6.63 33.53,6.63 33.51,6.61 33.5,6.61 33.02,6.13 v33.02,5.79
  Bottom 0.203: 33.02,6.43 v33.02,5.79
  Bottom 0.254: v7.72,7.85 7.87,8 12.42,8 14.96,5.46 24.77,5.46 26.16,6.86 32.59,6.86 33.02,6.43
VBAT  (via drill 0.35)
  Top 0.406: Q3.3 10.08,11.26 10.74,11.92 10.74,13.77 11.79,14.82 X1.2 12.83,16.64 v12.88,16.64 14.31,18.07 R12.4 16.53,21.57 MS1.28 | U3.3 14.42,12.9 | 14.42,12.9 C5.1 | v14.41,14.31 v14.42,14.3 14.42,12.9
  Bottom 0.406: v12.88,16.64 14.41,15.11 v14.41,14.31
VBUS  (via drill 0.35)
  Top 0.254: v6.47,12.81 6.47,12.73 5.97,12.73 | CHG.A 1.74,5.64 v1.69,5.59
  Top 0.406: X2.VBUS 5.97,12.73 8.13,12.73 D1.A | D1.A 8.64,11.4 9.06,10.99 v9.06,10.91 9.13,10.84 Q3.1 | D1.A 8.61,12.25 8.61,18.39 9.63,19.41 v9.63,19.46 | R12.1 19.13,19.89 20.83,21.59 MS1.26 | v14.4,10.08 14.4,8.8 U3.4 | U$1.27 35.29,4.1 35.28,4.09 35.31,4.06 v35.31,3.76 | v20.22,20.14 20.32,20.04 20.32,18.52 v20.4,18.44 | v25.04,3.83 23.9,4.98 v23.9,6.6
  Bottom 0.254: v6.47,12.81 6.52,12.76 6,12.24 6,10.25 6.73,9.52 6.73,6.88 5.73,5.89 1.99,5.89 v1.69,5.59
  Bottom 0.406: v9.63,19.46 9.68,19.51 9.87,19.51 10.32,19.96 20.04,19.96 v20.22,20.14 20.27,20.14 21.59,21.46 MS1.26 | v9.06,10.91 9.88,10.08 v14.4,10.08 | v20.4,18.44 20.4,16.39 20.8,15.98 20.8,7.95 21.46,7.29 21.97,7.29 22.61,6.66 23.85,6.66 v23.9,6.6 | v35.31,3.76 35.03,4.04 32.23,4.04 30.79,5.49 30.07,5.49 28.42,3.83 v25.04,3.83
VDIV  (via drill 0.35)
  Top 0.203: R12.6 R12.5 15.76,16.37 v15.34,16.79 | U$1.15 32.51,13.74 32.69,13.92 32.69,18.19 v32.54,18.34
  Bottom 0.203: v15.34,16.79 15.62,16.79 17.91,19.07 31.8,19.07 v32.54,18.34
VHI
  Top 0.254: 18.23,15.52 18.23,15.51
  Top 0.406: Q3.2 10.97,8.54 10.97,10.52 11.13,10.68 C7.2 12.37,10.83 12.37,11.84 12.34,11.87 D1.C 12.68,12.55 12.68,14.1 14.1,15.52 18.23,15.52 R12.7 | 18.23,15.51 18.81,14.94 19.43,14.94 19.85,14.52 U2.1

### Text on the board
tPlace: BAT | EN | USB | NC | A4 | A3 | A2 | A1 | D0 | A0 | SCL | SDA | t | j | rst | 3v | <AR | GND | D5 | D4 | NC | D2 | D1 | SCK | SI | SO | RX | TX | 1.06 | G
bPlace: 3.7/4.7 / LiPoly Battery / USB Charge | + | + | + | Nautilus840 | + | + | NRF52840 Feather | Timothy Garcia | + | 64Mhz / BLE / SPI Flash / 3.3V / https://github.com/eighthree/nautilus / Arduino + Circuitpython Compatible | + | + | + | + | + | + | 01.02.19 r1 | + | + | NFC2 | + | + | + | SWD | SWC | NFC1